# EAGLE design controller_board (EAGLE 9.4.0)
Assembly variants: Minimal, FullAwesome
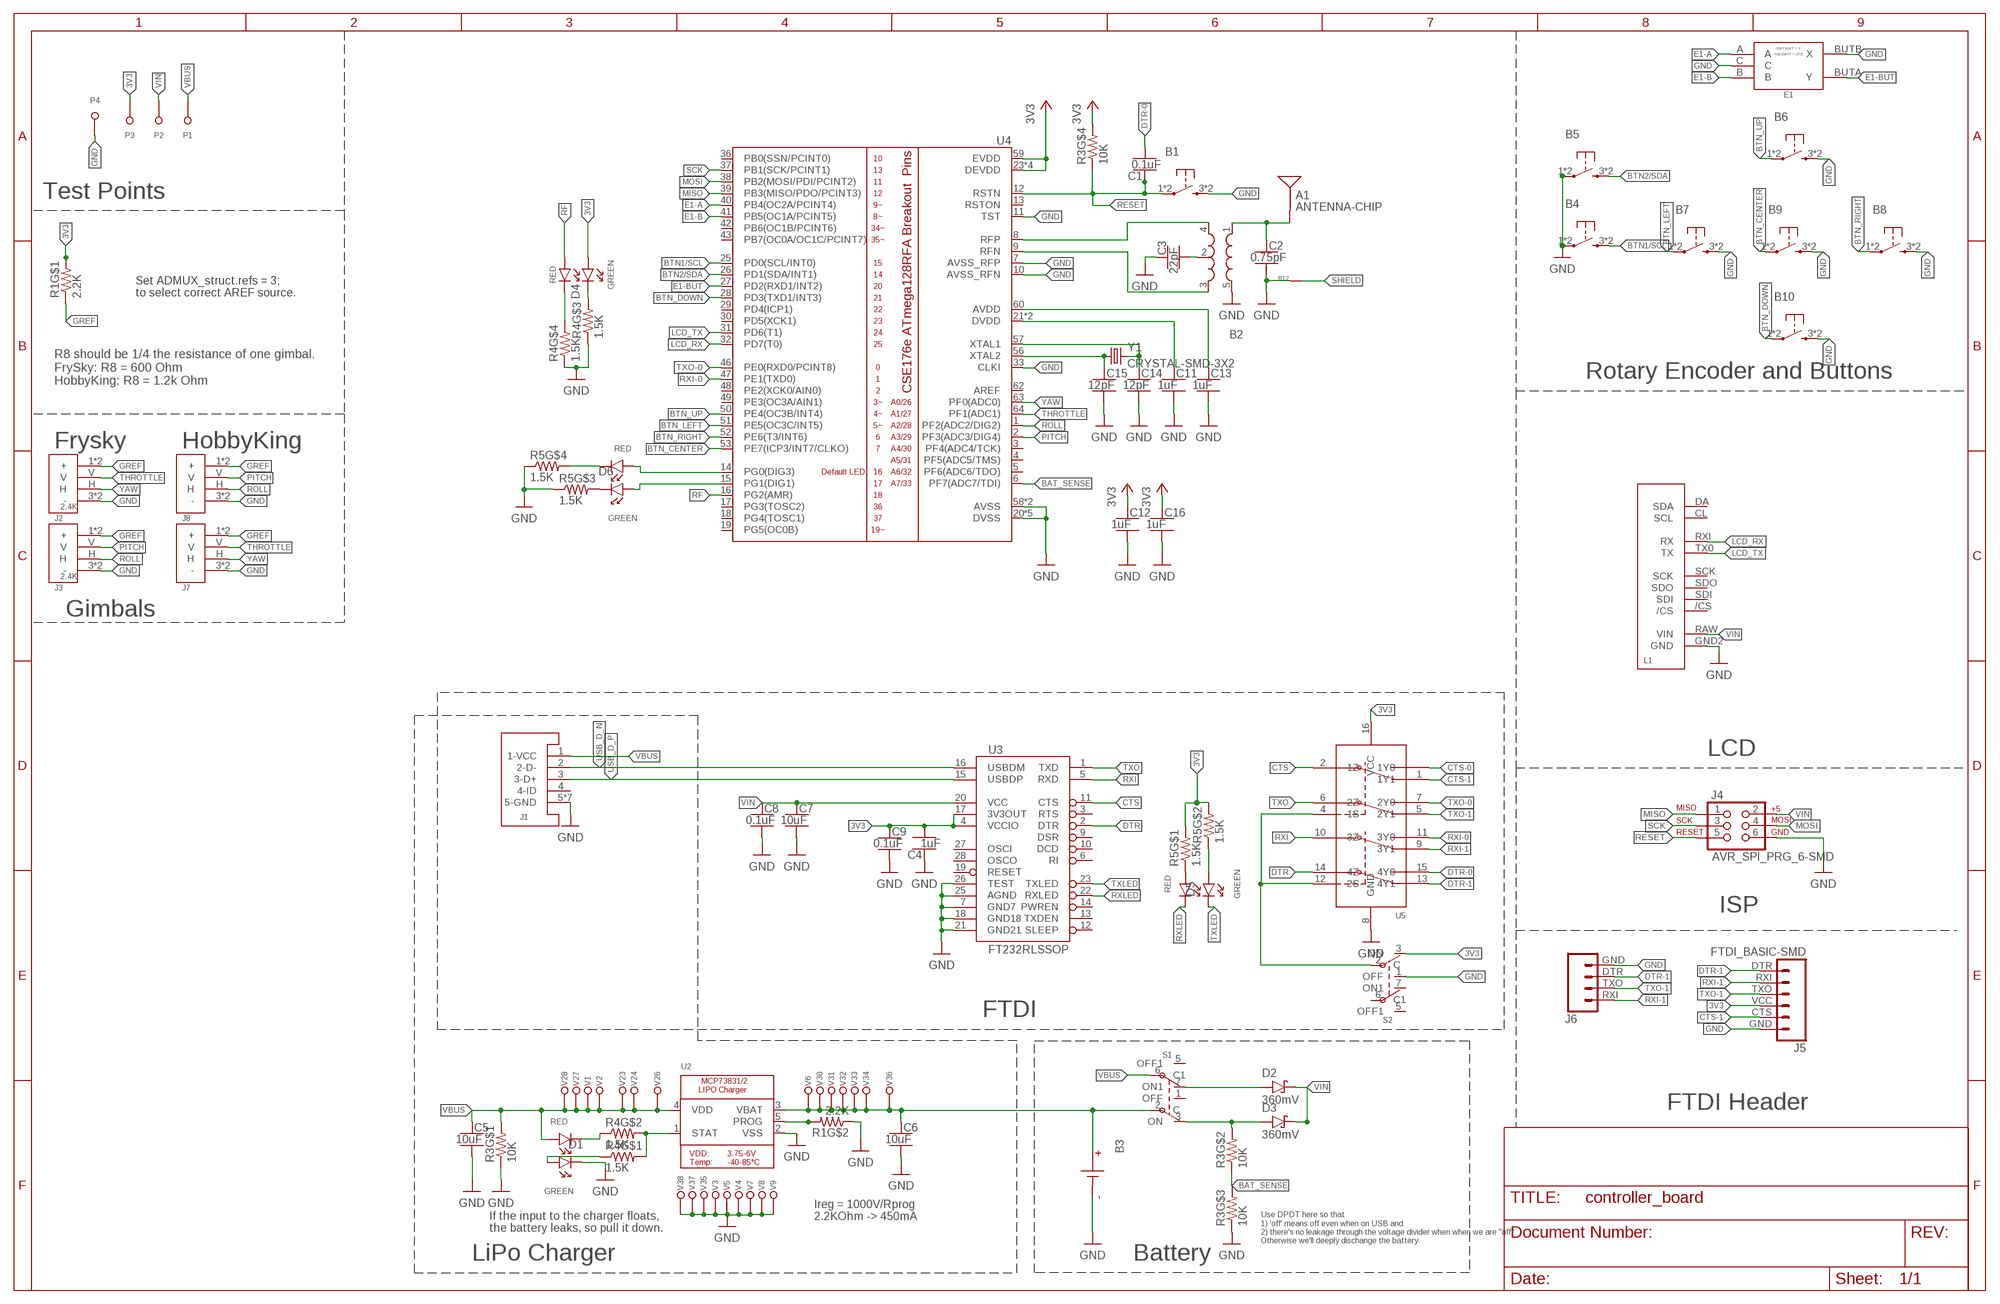
[diagram p0: schematic, sheet 1]
FRAME1 (FRAME_B_L): CREATOR: Unknown; DIST: Unknown; DISTPN: Unknown

## Parts
A1  ANTENNA-CHIP  [ANTENNA-CHIP]
B1  PUSHBUTTON_-4.5X4.5  [4.5MM_TACTILE_SWITCH_TL3305AF160QG]
B2  BALUN0805  [BALUN]
B3  BATTERY-SMD  [MOLEX-BATTERY-CONNECTOR-SMD-51005-2P]
B4  PUSHBUTTON_-4.5X4.5  [4.5MM_TACTILE_SWITCH_TL3305AF160QG]  (not fitted in variant Minimal)
B5  PUSHBUTTON_-4.5X4.5  [4.5MM_TACTILE_SWITCH_TL3305AF160QG]  (not fitted in variant Minimal)
B6  PUSHBUTTON_-4.5X4.5  [4.5MM_TACTILE_SWITCH_TL3305AF160QG]
B7  PUSHBUTTON_-4.5X4.5  [4.5MM_TACTILE_SWITCH_TL3305AF160QG]
B8  PUSHBUTTON_-4.5X4.5  [4.5MM_TACTILE_SWITCH_TL3305AF160QG]
B9  PUSHBUTTON_-4.5X4.5  [4.5MM_TACTILE_SWITCH_TL3305AF160QG]
B10  PUSHBUTTON_-4.5X4.5  [4.5MM_TACTILE_SWITCH_TL3305AF160QG]
B12  NET_BRIDGE  [NET_BRIDGE]
C1  0.1uF  CAPACITOR-NP_SMD-0603_CERAMIC-0.1UF  [CAPC1608X100]
C2  0.75pF  CAPACITOR-NP_SMD-0603_CERAMIC-0.75PF  [CAPC1608X100]
C3  22pF  CAPACITOR-NP_SMD-0603_CERAMIC-22PF  [CAPC1608X100]
C4  1uF  CAPACITOR-NP_SMD-0603_CERAMIC-1UF  [CAPC1608X100]
C5  10uF  CAPACITOR-NP_SMD-0603_CERAMIC-10UF  [CAPC1608X100]
C6  10uF  CAPACITOR-NP_SMD-0603_CERAMIC-10UF  [CAPC1608X100]
C7  10uF  CAPACITOR-NP_SMD-0603_CERAMIC-10UF  [CAPC1608X100]  (not fitted in variant Minimal)
C8  0.1uF  CAPACITOR-NP_SMD-0603_CERAMIC-0.1UF  [CAPC1608X100]  (not fitted in variant Minimal)
C9  0.1uF  CAPACITOR-NP_SMD-0603_CERAMIC-0.1UF  [CAPC1608X100]  (not fitted in variant Minimal)
C11  1uF  CAPACITOR-NP_SMD-0603_CERAMIC-1UF  [CAPC1608X100]
C12  1uF  CAPACITOR-NP_SMD-0603_CERAMIC-1UF  [CAPC1608X100]
C13  1uF  CAPACITOR-NP_SMD-0603_CERAMIC-1UF  [CAPC1608X100]
C14  12pF  CAPACITOR-NP_SMD-0603_CERAMIC-12PF  [CAPC1608X100]
C15  12pF  CAPACITOR-NP_SMD-0603_CERAMIC-12PF  [CAPC1608X100]
C16  1uF  CAPACITOR-NP_SMD-0603_CERAMIC-1UF  [CAPC1608X100]
D1  LED-2X-GREEN/RED-1.6X1.5MM  [LED-2X-LITE-ON-1.6MMX1.5MM]
D2  360mV  DIODE-SCHOTTKY_-SMD-SOD123  [SODFL3516X96]
D3  360mV  DIODE-SCHOTTKY_-SMD-SOD123  [SODFL3516X96]
D4  LED-2X-GREEN/RED-1.6X1.5MM  [LED-2X-LITE-ON-1.6MMX1.5MM]
D5  LED-2X-GREEN/RED-1.6X1.5MM  [LED-2X-LITE-ON-1.6MMX1.5MM]  (not fitted in variant Minimal)
D6  LED-2X-GREEN/RED-1.6X1.5MM  [LED-2X-LITE-ON-1.6MMX1.5MM]
E1  ROTARY-ENCODER-W/BUTTON-BOURNS-PEC12R-4217F  [BOURNS-PEC12R]
J1  USB-MICROA-AMPHENOL-10118192-0001LF  [USB-MICROA-10118192-0001LF]  (not fitted in variant Minimal)
J2  2.4K  FRSKY-GIMBAL-FRYSKY  [JST-13-PTH]  (not fitted in variant Minimal)
J3  2.4K  FRSKY-GIMBAL-FRYSKY  [JST-13-PTH]  (not fitted in variant Minimal)
J4  AVR_SPI_PRG_6-SMD  [2X3-SMD]
J5  FTDI_BASIC-SMD  [FTDI-BASIC-SMD]
J6  FTDI-4PIN-RIGHT-ANGLE-SMD  [HEADER-2X2-0.1IN-MALE-RIGHT-ANGLE-SMD]
J7  FRSKY-GIMBAL-2X-SERVO-SMD  [2X-SERVO-SMD]
J8  FRSKY-GIMBAL-2X-SERVO-SMD  [2X-SERVO-SMD]
L1  SPARKFUN_SERLCD_SERIAL_REDUCED-SMD  [SPARKFUN_SERLCD_16X2_REDUCED_SMD]
P1  TEST-POINT  [TEST-POINT-KEYSTONE-5000]  (not fitted in variant Minimal)
P2  TEST-POINT  [TEST-POINT-KEYSTONE-5000]  (not fitted in variant Minimal)
P3  TEST-POINT  [TEST-POINT-KEYSTONE-5000]  (not fitted in variant Minimal)
P4  TEST-POINT  [TEST-POINT-KEYSTONE-5000]  (not fitted in variant Minimal)
R1  2.2K  RESISTOR-PACK-4X-2.2K  [RESCAXS50P200X100X45-8]
R3  10K  RESISTOR-PACK-4X-10K  [RESCAXS50P200X100X45-8]
R4  1.5K  RESISTOR-PACK-4X-1.5K  [RESCAXS50P200X100X45-8]
R5  1.5K  RESISTOR-PACK-4X-1.5K  [RESCAXS50P200X100X45-8]
S1  SWITCH-DPDT-300MA-6V-SMD  [JS202011JCQN]
S2  SWITCH-DPDT-300MA-6V-SMD  [JS202011JCQN]
U2  MCP73831T-2ACI/OT  MCP73831/2  [SOT23-5]
U3  FT232RLSSOP  [SSOP28DB]  (not fitted in variant Minimal)
U4  ATMEGA128RFA1  [QFN-64]
U5  DPDT-X2  [SOP65P640X110-16]  (not fitted in variant Minimal)
V1  LOCKED-VIA-0.2  [VIA-0.2MM]
V2  LOCKED-VIA-0.2  [VIA-0.2MM]
V3  LOCKED-VIA-0.2  [VIA-0.2MM]
V4  LOCKED-VIA-0.2  [VIA-0.2MM]
V5  LOCKED-VIA-0.2  [VIA-0.2MM]
V6  LOCKED-VIA-0.2  [VIA-0.2MM]
V7  LOCKED-VIA-0.2  [VIA-0.2MM]
V8  LOCKED-VIA-0.2  [VIA-0.2MM]
V9  LOCKED-VIA-0.2  [VIA-0.2MM]
V23  LOCKED-VIA-0.2  [VIA-0.2MM]
V24  LOCKED-VIA-0.2  [VIA-0.2MM]
V26  LOCKED-VIA-0.2  [VIA-0.2MM]
V27  LOCKED-VIA-0.2  [VIA-0.2MM]
V28  LOCKED-VIA-0.2  [VIA-0.2MM]
V30  LOCKED-VIA-0.2  [VIA-0.2MM]
V31  LOCKED-VIA-0.2  [VIA-0.2MM]
V32  LOCKED-VIA-0.2  [VIA-0.2MM]
V33  LOCKED-VIA-0.2  [VIA-0.2MM]
V34  LOCKED-VIA-0.2  [VIA-0.2MM]
V35  LOCKED-VIA-0.2  [VIA-0.2MM]
V36  LOCKED-VIA-0.2  [VIA-0.2MM]
V37  LOCKED-VIA-0.2  [VIA-0.2MM]
V38  LOCKED-VIA-0.2  [VIA-0.2MM]
Y1  CRYSTAL-SMD-3X2  [OSCCC320X250X85]

## Nets
3V3 [PWR]: C4.2 C9.1 C12.1 C16.1 D4.A1 J5.VCC P3.T R1.5 R3.8 R5.5 R5.6 S2.3(ON) U3.4(VCCIO) U3.17(3V3OUT) U4.23(DEVDD) U4.34(DEVDD) U4.44(DEVDD) U4.54(DEVDD) U4.59(EVDD) U5.16(VCC)
ANTENNA [RFSIG]: A1.FEED(SIGNAL) B2.1(IN) C2.1
BAT_SENSE: R3.3 R3.7 U4.6(PF7(ADC7/TDI))
BCAP: B2.2(GND) C3.2
BPOS [HIGH-I]: B3.P C6.1 S1.2(C) U2.3(VBAT) V6.P1(N) V30.P1(N) V31.P1(N) V32.P1(N) V33.P1(N) V34.P1(N) V36.P1(N)
BTN1/SCL: B4.3 B4.4 U4.25(PD0(SCL/INT0))
BTN2/SDA: B5.3 B5.4 U4.26(PD1(SDA/INT1))
BTN_CENTER: B9.1 B9.2 U4.53(PE7(ICP3/INT7/CLKO))
BTN_DOWN: B10.1 B10.2 U4.28(PD3(TXD1/INT3))
BTN_LEFT: B7.1 B7.2 U4.51(PE5(OC3C/INT5))
BTN_RIGHT: B8.1 B8.2 U4.52(PE6(T3/INT6))
BTN_UP: B6.1 B6.2 U4.50(PE4(OC3B/INT4))
CLK_NEG: C15.1 U4.56(XTAL2) Y1.1
CLK_POS: C14.1 U4.57(XTAL1) Y1.3
CTS: U3.11(CTS) U5.2(1Z)
CTS-0: U5.3(1Y0)
CTS-1: J5.CTS U5.1(1Y1)
DTR: U3.2(DTR) U5.14(4Z)
DTR-0: C1.2 U5.15(4Y0)
DTR-1: J5.DTR J6.DTR U5.13(4Y1)
E1-A: E1.A U4.40(PB4(OC2A/PCINT4))
E1-B: E1.B U4.41(PB5(OC1A/PCINT5))
E1-BUT: E1.BUTA(Y) U4.27(PD2(RXD1/INT2))
GND [PWR]: B1.3 B1.4 B2.5(GND) B3.G2(N) B3.G3(N) B3.G(N) B4.1 B4.2 B5.1 B5.2 B6.3 B6.4 B7.3 B7.4 B8.3 B8.4 B9.3 B9.4 B10.3 B10.4 B12.P1 C2.2 C3.1 C4.1 C5.2 C6.2 C7.2 C8.2 C9.2 C11.2 C12.2 C13.2 C14.2 C15.2 C16.2 D1.C1 E1.BUTB(X) E1.C J1.5(5-GND) J1.6(5-GND) J1.7(5-GND) J1.8(5-GND) J1.9(5-GND) J1.10(5-GND) J1.11(5-GND) J2.3(-) J2.6(-) J3.3(-) J3.6(-) J4.6 J5.GND J6.GND J7.3(-) J7.6(-) J8.3(-) J8.6(-) L1.GND2(GND) P4.T R1.3 R3.2 R3.4 R4.1 R4.2 R5.1 R5.2 S2.1(OFF) U2.2(VSS) U3.7(GND7) U3.18(GND18) U3.21(GND21) U3.25(AGND) U3.26(TEST) U4.7(AVSS_RFP) U4.10(AVSS_RFN) U4.11(TST) U4.20(DVSS) U4.24(DVSS) U4.33(CLKI) U4.35(DVSS) U4.45(DVSS) U4.55(DVSS) U4.58(AVSS) U4.61(AVSS) U5.8(GND) V3.P1(N) V4.P1(N) V5.P1(N) V7.P1(N) V8.P1(N) V9.P1(N) V35.P1(N) V37.P1(N) V38.P1(N)
GREF: J2.1(+) J2.4(+) J3.1(+) J3.4(+) J7.1(+) J7.4(+) J8.1(+) J8.4(+) R1.4
LCD_RX: L1.RXI(RX) U4.32(PD7(T0))
LCD_TX: L1.TX0(TX) U4.31(PD6(T1))
MISO: J4.1 U4.39(PB3(MISO/PDO/PCINT3))
MOSI: J4.4 U4.38(PB2(MOSI/PDI/PCINT2))
N$1: D1.A1 R4.4
N$2: D1.C2 R4.3
N$3: D5.A1 R5.3
N$4: D6.C2 R5.8
N$5: D6.C1 R5.7
N$6: D4.C1 R4.7
N$7: D5.A2 R5.4
N$8: D6.A2 U4.14(PG0(DIG3))
N$9: D6.A1 U4.15(PG1(DIG1))
N$11: R4.5 R4.6 U2.1(STAT)
N$12: R1.6 U2.5(PROG)
N$13: D4.C2 R4.8
N$14: D2.2(A) S1.7(ON1)
N$20: C11.1 U4.21(DVDD) U4.22(DVDD)
N$21: C13.1 U4.60(AVDD)
PITCH: J3.V J8.V U4.2(PF3(ADC3/DIG4))
PROG_SEL: S2.2(C) U5.4(1S) U5.12(2S)
RESET: B1.1 B1.2 C1.1 J4.5 R3.1 U4.12(RSTN)
RF: D4.A2 U4.16(PG2(AMR))
RF_N: B2.3(OUT2) U4.9(RFN)
RF_P: B2.4(OUT1) U4.8(RFP)
ROLL: J3.H J8.H U4.1(PF2(ADC2/DIG2))
RXI: U3.5(RXD) U5.10(3Z)
RXI-0: U4.47(PE1(TXD0)) U5.11(3Y0)
RXI-1: J5.RXI J6.RXI U5.9(3Y1)
RXLED: D5.C2 U3.22(RXLED)
SCK: J4.3 U4.37(PB1(SCK/PCINT1))
SHIELD: B12.P2
THROTTLE: J2.V J7.V U4.64(PF1(ADC1))
TXLED: D5.C1 U3.23(TXLED)
TXO: U3.1(TXD) U5.6(2Z)
TXO-0: U4.46(PE0(RXD0/PCINT8)) U5.7(2Y0)
TXO-1: J5.TXO J6.TXO U5.5(2Y1)
USB_D_N: J1.2(2-D-) U3.16(USBDM)
USB_D_P: J1.3(3-D+) U3.15(USBDP)
VBAT [HIGH-I]: D3.2(A) R3.6 S1.3(ON)
VBUS [HIGH-I]: C5.1 D1.A2 J1.1(1-VCC) P1.T R3.5 S1.6(C1) U2.4(VDD) V1.P1(N) V2.P1(N) V23.P1(N) V24.P1(N) V26.P1(N) V27.P1(N) V28.P1(N)
VIN [HIGH-I]: C7.1 C8.1 D2.1(C) D3.1(C) J4.2 L1.RAW(VIN) P2.T U3.20(VCC)
YAW: J2.H J7.H U4.63(PF0(ADC0))
Unconnected: J1.4(4-ID) L1./CS L1.CL(SCL) L1.DA(SDA) L1.SCK L1.SDI L1.SDO R1.1 R1.2 R1.7 R1.8 S1.1(OFF) S1.5(OFF1) S2.5(OFF1) S2.6(C1) S2.7(ON1) U3.3(RTS) U3.6(RI) U3.9(DSR) U3.10(DCD) U3.12(SLEEP) U3.13(TXDEN) U3.14(PWREN) U3.19(RESET) U3.27(OSCI) U3.28(OSCO) U4.3(PF4(ADC4/TCK)) U4.4(PF5(ADC5/TMS)) U4.5(PF6(ADC6/TDO)) U4.13(RSTON) U4.17(PG3(TOSC2)) U4.18(PG4(TOSC1)) U4.19(PG5(OC0B)) U4.29(PD4(ICP1)) U4.30(PD5(XCK1)) U4.36(PB0(SSN/PCINT0)) U4.42(PB6(OC1B/PCINT6)) U4.43(PB7(OC0A/OC1C/PCINT7)) U4.48(PE2(XCK0/AIN0)) U4.49(PE3(OC3A/AIN1)) U4.62(AREF)

## Notes on the sheet
- Test Points
- Set ADMUX_struct.refs = 3;
  to select correct AREF source.
- Rotary Encoder and Buttons
- R8 should be 1/4 the resistance of one gimbal.
  FrySky: R8 = 600 Ohm
  HobbyKing: R8 = 1.2k Ohm
- Frysky | HobbyKing
- Gimbals
- LCD
- ISP
- FTDI
- FTDI Header
- Ireg = 1000V/Rprog
  2.2KOhm -> 450mA
- If the input to the charger floats, 
  the battery leaks, so pull it down.
- Use DPDT here so that 
  1) 'off' means off even when on USB and 
  2) there's no leakage through the voltage divider when when we are "off"  
  Otherwise we'll deeply dischange the battery.
- LiPo Charger | Battery

## Library data of the parts
A1 = quadparts_prebuilt:ANTENNA: Single endded antenna.; CREATOR: Swanson; DATASHEET: http://www.linxtechnologies.com/resources/data-guides/ant-xxx-chp-x.pdf; DESC: RF ANT 2.4GHZ CHIP SOLDER SMD; DIST: Digikey; DISTPN: ANT-2.45-CHPCT-ND; MFR: Linx Technologies Inc.; MOUNTING: SMD; MPN: ANT-2.45-CHP-T; PRICE: 3.16; REVIEWER: Swanson
B1 B4-B10 = quadparts_prebuilt:PUSHBUTTON_: "Tactile" or "clicky" button.; CREATOR: Swanson; DESC: SWITCH TACTILE SPST-NO 50MA 12V; DIST: DIGIKEY; DISTPN: EG5350CT-ND; MFR: E-Switch; MOUNTING: SMD; MPN: TL3305AF160QG
B2 = quadparts_prebuilt:BALUN: A balun to convert differential radio-frequency outputs from the microcontroller into a single-ended driver for the antenna.; CREATOR: Swanson; DATASHEET: http://katalog.we-online.de/pbs/datasheet/748421245.pdf; DESC: BALUN 2.4GHZ-2.5GHZ 50/100 0805; DIST: Digikey; DISTPN: 732-2230-1-ND; MFR: Wurth Electronics Inc.; MOUNTING: SMD; MPN: 748421245; PACKAGE: 0805; PRICE: 2.63; REVIEWER: Swanson
B3 = quadparts_prebuilt:BATTERY: Connections for a battery.; CREATOR: Swanson; DIST: ALIBABA; DISTPN: https://www.alibaba.com/product-detail/Molex-51005-51006-2-pin-female_60863668004.html?spm=a2700.7724857.normalList.97.20ef28e64nZnNK; MFR: UNKNOWN; MOUNTING: SMD; MPN: UNKNOWN
B12 = custom:NET_BRIDGE; CREATOR: Michael Gonzalez; DIST: NA; DISTPN: NA
C1 C8 C9 = quadparts_prebuilt:CAPACITOR-NP_: Nonpolarized capacitor; CREATOR: Swanson; DESC: CAP CER 0.1UF 10V X7R 0603; DIST: Digikey; DISTPN: 399-1095-1-ND; MFR: KEMET; MOUNTING: SMD; MPN: C0603C104K8RACTU; PACKAGE: 0603
C2 = quadparts_prebuilt:CAPACITOR-NP_: Nonpolarized capacitor; CREATOR: Swanson; DESC: CAP CER 0.75PF 50V NPO 0603; DIST: Digikey; DISTPN: 311-3843-1-ND; MFR: Yageo; MOUNTING: SMD; MPN: CC0603BRNPO9BNR75; PACKAGE: 0603
C3 = quadparts_prebuilt:CAPACITOR-NP_: Nonpolarized capacitor; CREATOR: Swanson; DESC: CAP CER 22PF 6.3V NP0 0603; DIST: Digikey; DISTPN: 478-11384-1-ND; MFR: AVX Corporation; MOUNTING: SMD; MPN: 06036A220KAT2A; PACKAGE: 0603
C4 C11-C13 C16 = quadparts_prebuilt:CAPACITOR-NP_: Nonpolarized capacitor; CREATOR: Swanson; DESC: CAP CER 1UF 10V X5R 0603; DIST: Digikey; DISTPN: 1276-1182-1-ND; MFR: Samsung Electro-Mechanics; MOUNTING: SMD; MPN: CL10A105KP8NNNC; PACKAGE: 0603
C5-C7 = quadparts_prebuilt:CAPACITOR-NP_: Nonpolarized capacitor; CREATOR: Swanson; DESC: CAP CER 10UF 6.3V X5R 0603; DIST: Digikey; DISTPN: 1276-1119-1-ND; MFR: Samsung Electro-Mechanics; MOUNTING: SMD; MPN: CL10A106MQ8NNNC; PACKAGE: 0603
C14 C15 = quadparts_prebuilt:CAPACITOR-NP_: Nonpolarized capacitor; CREATOR: Swanson; DESC: CAP CER 12PF 10V C0G/NP0 0603; DIST: Digikey; DISTPN: 720-1655-1-ND; MFR: Vishay Vitramon; MOUNTING: SMD; MPN: VJ0603A120FXQCW1BC; PACKAGE: 0603
D1 D4-D6 = RemoteParts:LED-2X; COLOR1: RED; COLOR2: GREEN; CREATOR: Swanson; DESC: LED GREEN/RED CLEAR CHIP SMD; DIST: DIGIKEY; DISTPN: 160-2252-1-ND; MFR: Lite-On Inc.; MOUNTING: SMD; MPN: LTST-C195TGKRKT; PACKAGE: 4SMD
D2 D3 = quadparts_prebuilt:DIODE-SCHOTTKY_: Schottky diode; CREATOR: Swanson; DESC: DIODE SCHOTTKY 30V 1.5A SFLAT; DIST: Digikey; DISTPN: CRS08QMCT-ND; MFR: Toshiba Semiconductor and Storage; MOUNTING: SMD; MPN: CRS08(TE85L,Q,M); REVIEWER: Swanson
E1 = RemoteParts:ROTARY-ENCODER-W/BUTTON; AUX1DIST: DIGIKEY; AUX1DISTPN: 1722-1241-ND; CREATOR: Swanson; DETENT: Y; DIST: DIGIKEY; DISTPN: PEC12R-4217F-S0024-ND; HEIGHT: 17.5; MOUNTING: TH
J1 = RemoteParts:USB; CREATOR: Swanson; DIST: DIGIKEY; DISTPN: 609-4613-1-ND; MOUNTING: SMD
J2 = RemoteParts:FRSKY-GIMBAL; CREATOR: Swanson; DESC: CONN HEADER VERT 12POS 2MM; DIST: Digikey; DISTPN: A100106-ND; MFR: TE Connectivity AMP Connectors; MOUNTING: TH; MPN: 1-1735446-2
J3 = RemoteParts:FRSKY-GIMBAL; CREATOR: Swanson; DESC: CONN HEADER VERT 12POS 2MM; DIST: Digikey; DISTPN: A100106-ND; MFR: TE Connectivity AMP Connectors; MOUNTING: TH; MPN: 1-1735446-2; SPICEPREFIX: E
J4 = quadparts_prebuilt:AVR_SPI_PRG_6: AVR ISP 6 Pin This is the in-system programming (ISP) connector for Atmel Microcontrollers programming.; CREATOR: Swanson; DESC: CONN HEADER SMD 6POS 2.54MM; DIST: Digikey; DISTPN: 609-3487-2-ND; MFR: Amphenol ICC (FCI); MOUNTING: SMD; MPN: 95278-101A06LF
J5 = quadparts_prebuilt:FTDI_BASIC: FTDI (USB-serial converter) header bins with labels.; CREATOR: Swanson; DESC: CONN HEADER SMD R/A 6POS 2.54MM; DIST: DIGIKEY; DISTPN: 952-3235-ND; LEFT_PIN: B; MFR: Harwin Inc.; MOUNTING: SMD; MPN: M20-8890645; RIGHT_PIN: G
J6 = quadparts_prebuilt:FTDI-4PIN; CREATOR: Swanson; DIST: DIGIKEY; DISTPN: SAM15344-ND; MOUNTING: SMD
J7 J8 = RemoteParts:FRSKY-GIMBAL; CREATOR: Swanson; DESC: CONN HEADER SMD R/A 6POS 2.54MM; DIST: DIGIKEY; DISTPN: 952-3235-ND; MFR: Harwin Inc.; MOUNTING: SMD; MPN: M20-8890645
L1 = RemoteParts:SPARKFUN_SERLCD_SERIAL_REDUCED; AUX1DIST: DIGIKEY; AUX1DISTPN: 952-1842-ND; AUX2DIST: Digikey; AUX2DISTPN: S5641-ND; CREATOR: Swanson; DIST: Sparkfun; DISTPN: LCD-14072
P1-P4 = RemoteParts:TEST-POINT; CREATOR: Swanson; DESC: PC TEST POINT MINIATURE BLACK; DIST: DIGIKEY; DISTPN: 36-5001-ND; MFR: Keystone Electronics; MOUNTING: TH; MPN: 5001
R1 = quadparts_prebuilt:RESISTOR-PACK-4X; CREATOR: Swanson; DIST: DIGIKEY; DISTPN: Y10222CT-ND; MOUNTING: SMD
R3 = quadparts_prebuilt:RESISTOR-PACK-4X; CREATOR: Swanson; DESC: RES ARRAY 4 RES 10K OHM 0804; DIST: DIGIKEY; DISTPN: Y10103CT-ND; MFR: Panasonic Electronic Components; MOUNTING: SMD; MPN: EXB-N8V103JX; PACKAGE: 0804
R4 R5 = quadparts_prebuilt:RESISTOR-PACK-4X; CREATOR: Swanson; DIST: DIGIKEY; DISTPN: Y10152CT-ND; MOUNTING: SMD
S1 S2 = RemoteParts:SWITCH-DPDT; CREATOR: Swanson; DIST: DIGIKEY; DISTPN: CKN10723CT-ND; MOUNTING: SMD
U2 = RemoteParts:MCP73831/2: MCP73831/2 LIPO Charger VDD: 3.75 - 6V Temp -40 - 85°C Programmable Charge Rate: 15-500mA NOTE: STAT is a tri-state logic output on the MCP73831 and an open-drain output on the MCP73832. SOT23-5 with 4.2V output and tri-state logic on STAT = MCP73831T-2ACI/OT; CREATOR: Adafruit; DESC: IC CONTROLLR LI-ION 4.2V SOT23-5; DIST: DIGIKEY; DISTPN: MCP73831T-2ACI/OTCT-ND; MFR: Microchip Technology; MOUNTING: SMD; MPN: MCP73831T-2ACI/OT; PACKAGE: SOT23-5
U3 = RemoteParts:FT232RL: USB UART FT232RL 4th Generation USB UART (USB <-> Serial) Controller. Spark Fun Electronics SKU : COM-00650; CREATOR: Swanson; DIST: DIGIKEY; DISTPN: 768-1007-1-ND; MOUNTING: SMD
U4 = quadparts_prebuilt:ATMEGA128RFA1: ATmega128RFA1 8-bit AVR Microcontroller with Low Power 2.4GHz Transceiver for ZigBee and IEEE 802.15.4; CREATOR: Swanson; DATASHEET: http://www.atmel.com/Images/Atmel-8266-MCU_Wireless-ATmega128RFA1_Datasheet.pdf; DESC: IC RF TXRX+MCU 802.15.4 64VFQFN; DIST: Digikey; DISTPN: ATMEGA128RFA1-ZU-ND; MFR: Microchip Technology; MOUNTING: SMD; MPN: ATMEGA128RFA1-ZU; PACKAGE: QFN; PRICE: 10.21; REVIEWER: Swanson
U5 = RemoteParts:DPDT-X2; CREATOR: Swanson; DESC: IC ANALOG SWITCH DPDT 16TSSOP; DIST: DIGIKEY; DISTPN: 568-5300-1-ND; MFR: NXP USA Inc.; MOUNTING: SMD; MPN: NX3L2467PW,118
V1-V9 V23 V24 V26-V28 V30-V38 = quadparts_prebuilt:LOCKED-VIA: A via that be removed via ripup.; CREATOR: Swanson; DIST: NA; DISTPN: NA; MOUNTING: NONE
Y1 = quadparts_prebuilt:CRYSTAL: Crystals to provide clock references for microcontrollers, etc.; CREATOR: Swanson; DESC: CRYSTAL 16.0000MHZ 18PF SMD; DIST: DIGIKEY; DISTPN: 535-9134-1-ND; MFR: Abracon LLC; MOUNTING: SMD; MPN: ABM8-16.000MHZ-B2-T

## Net classes
1 HIGH-I: width 0.508 mm, drill 0.381 mm
2 RFSIG: width 1.016 mm

## Board
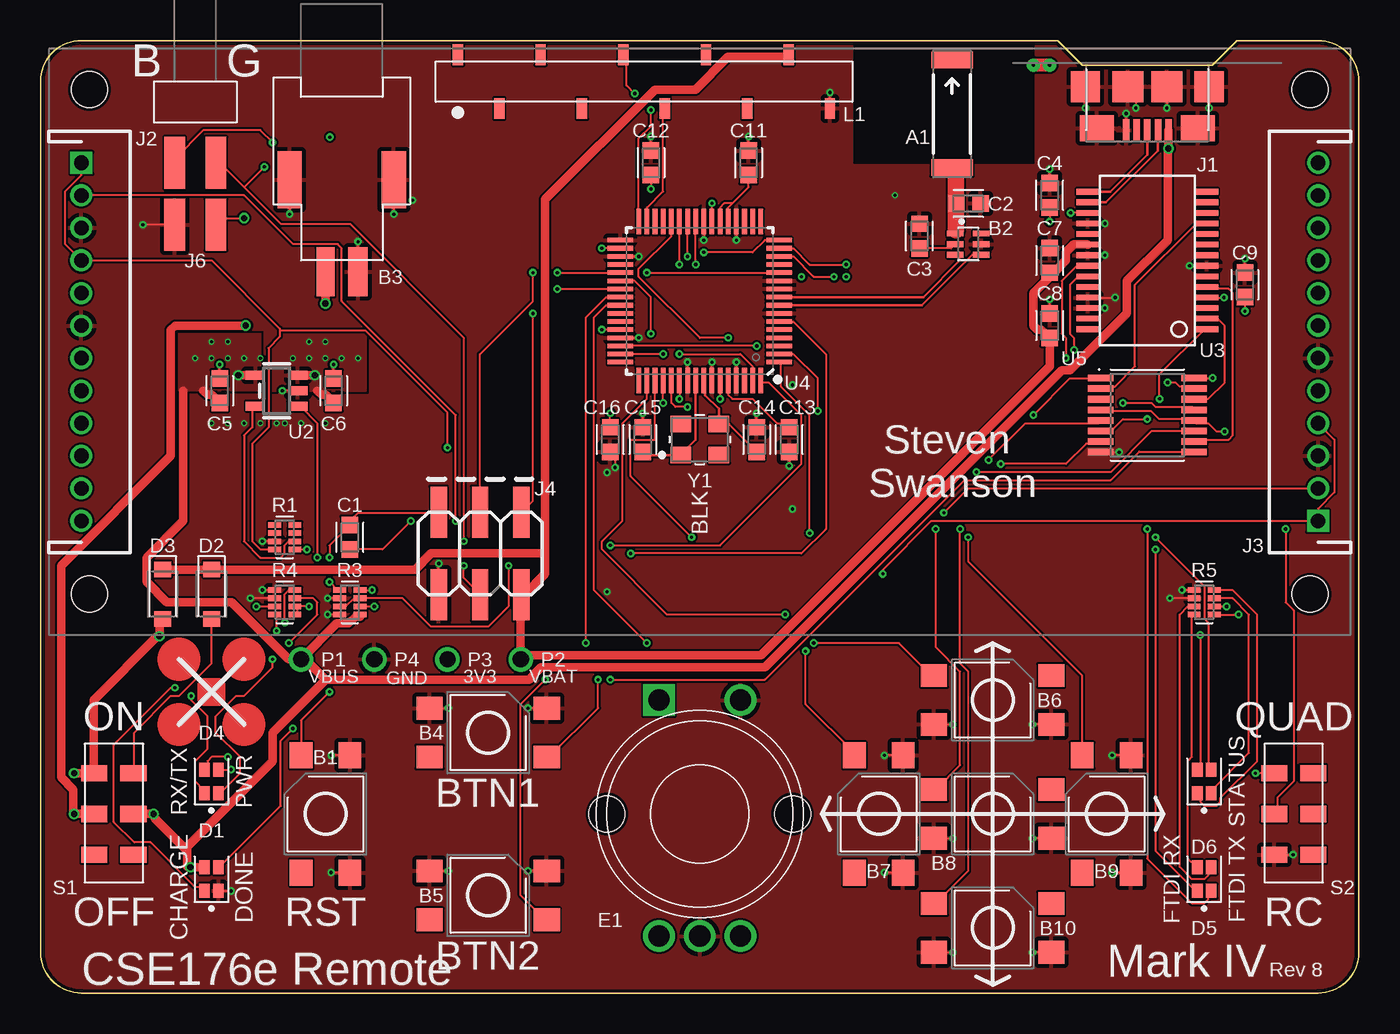
[diagram p1: board, top side]
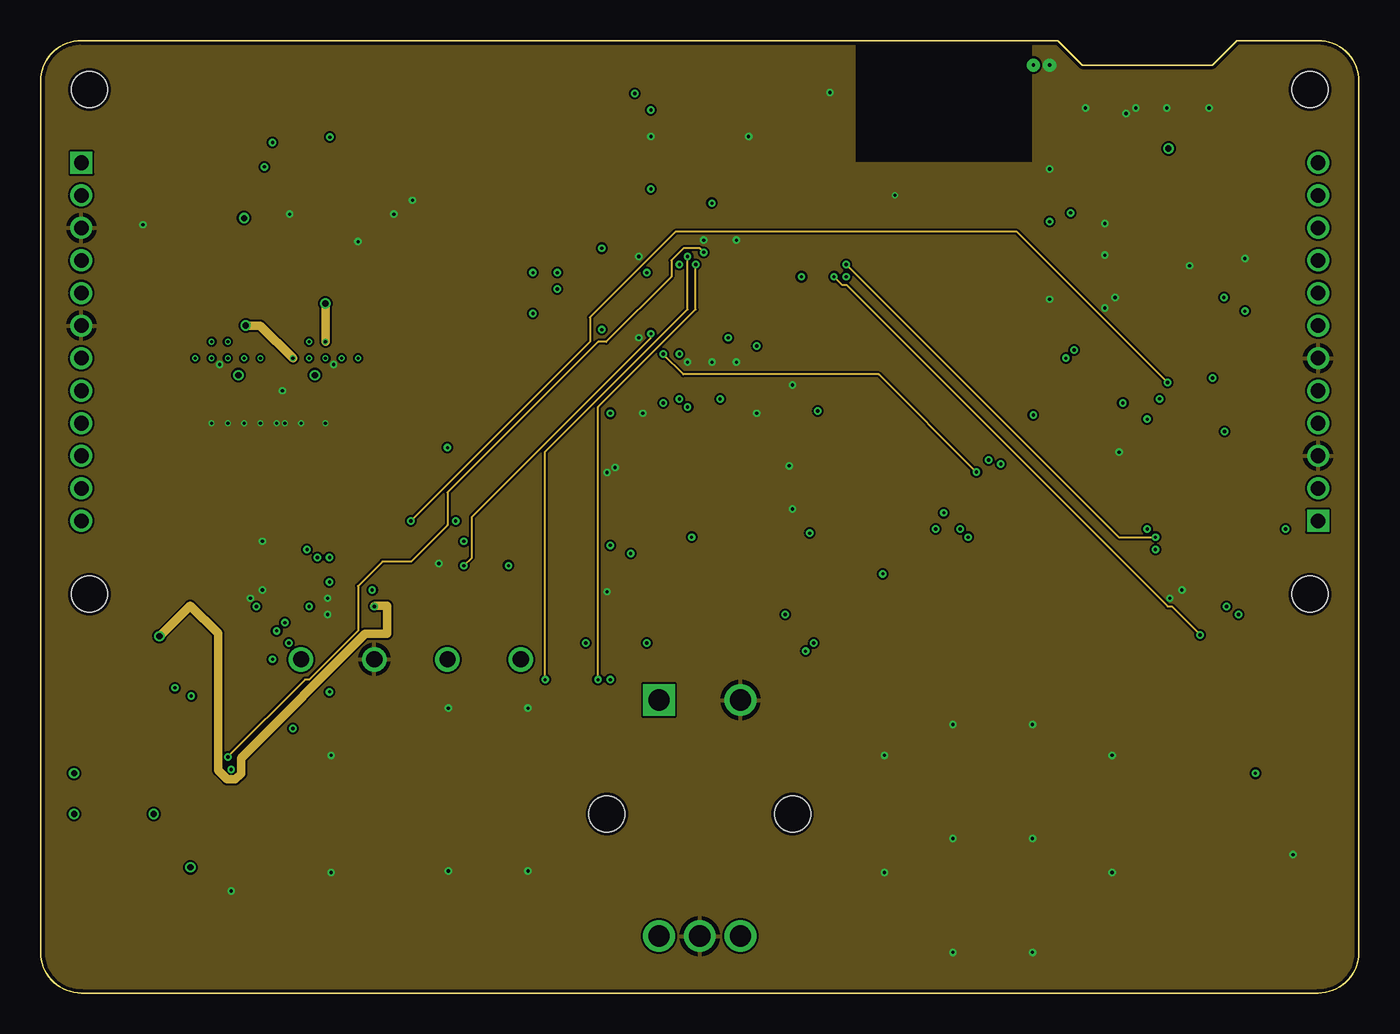
[diagram p2: board, inner layer Route2]
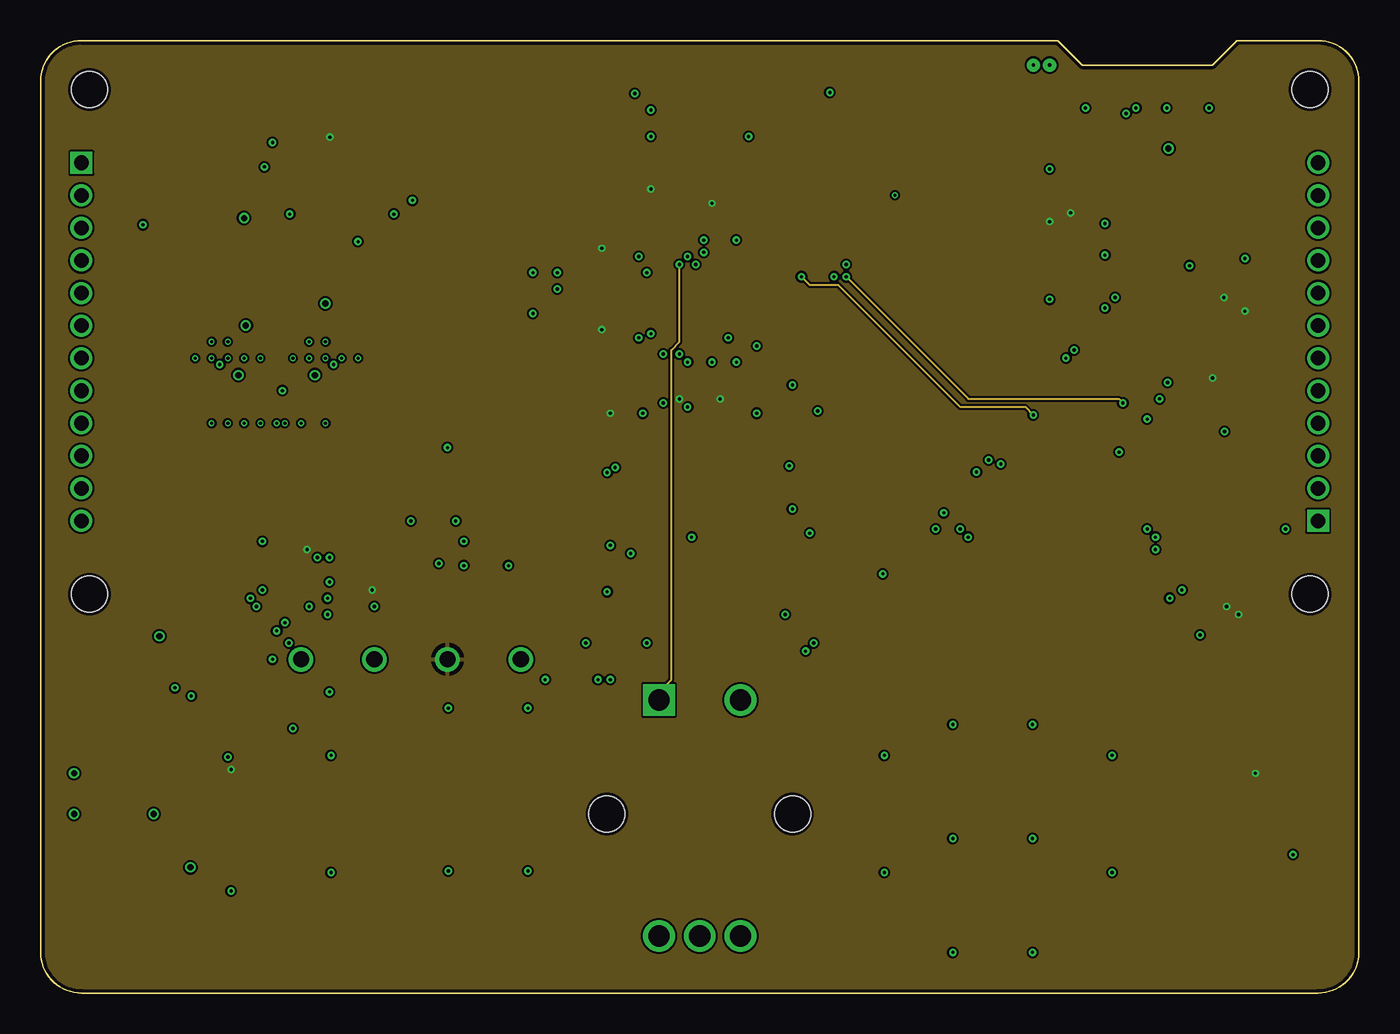
[diagram p3: board, inner layer Route15]
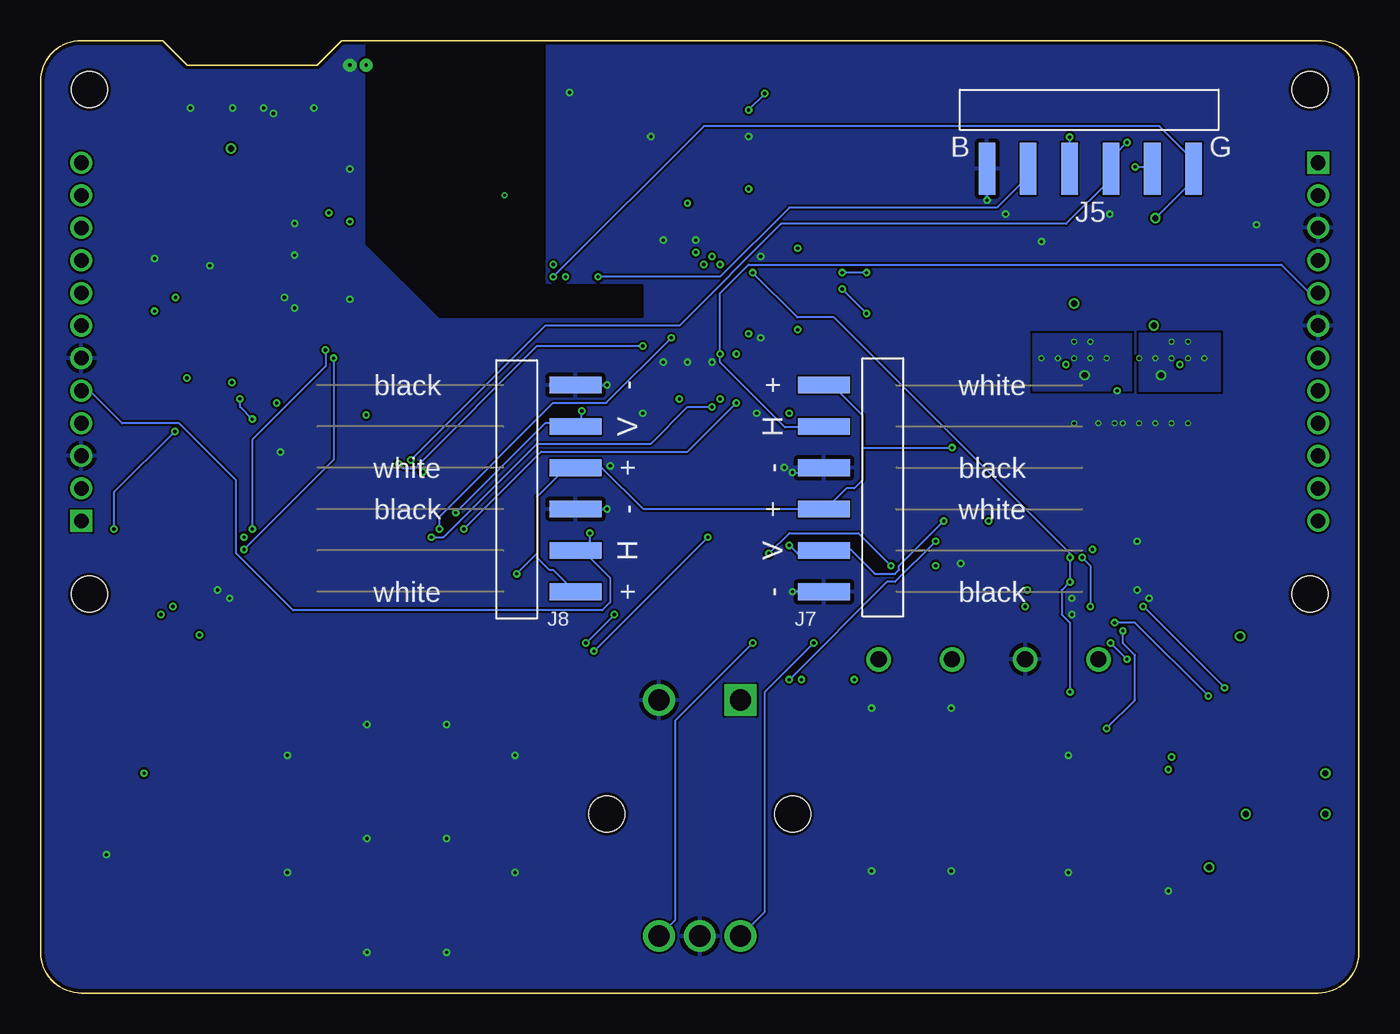
[diagram p4: board, bottom side, seen from below]

Size 81 x 58.5 mm. Coordinates in mm from the lower left corner, seen from the top.
Outline: 2.5,0 78.5,0 arc90 81,2.5 81,56 arc90 78.5,58.5 73.5,58.5 72,57 64,57 62.5,58.5 2.5,58.5 arc90 0,56 0,2.5 arc90 2.5,0
Copper layers (1*2*15*16): Top 0.035559375mm / dielectric 1.501140625mm / Route2 0.035559375mm / dielectric 0.149859375mm / Route15 0.035559375mm / dielectric 0.200659375mm / Bottom 0.035559375mm
Design rules "jlcpcb-4layer-5mil-small-cream": minimum track width 5mil, minimum drill 0.2mm, track to track 5mil, track to pad 5mil, pad to pad 5mil, via to via 5mil, smd to smd 5mil, copper to edge 0.2mm, drill to drill 10mil, minimum pad ring 3mil, minimum via ring 5mil, stop-mask expansion 3mil, vias tented up to drill 0.45mm, thermal gap 10mil
tRestrict: 4 lines
bRestrict: area 44,41.5 to 61,59

### Footprints (pad centres in the part's own frame; a part is rotated, then mirrored left to right if it is on the bottom)
ANTENNA-CHIP = smd 1.016 x 2.54: FEED -3.302,0; NC 3.302,0
4.5MM_TACTILE_SWITCH_TL3305AF160QG = smd 1.6 x 1.4: 1 -3.6,-1.5; 2 3.6,-1.5; 3 -3.6,1.5; 4 3.6,1.5
BALUN = smd 0.35 x 1: 1 -0.65,-0.8; 2 0,-0.8; 3 0.65,-0.8; 4 0.65,0.8; 5 0,0.8; 6 -0.65,0.8
MOLEX-BATTERY-CONNECTOR-SMD-51005-2P = smd 1.2 x 3: G -1,5.2 | smd 1.5 x 3.5: G2 -3.2,-0.45; G3 3.2,-0.45 | smd 1.1 x 3: P 1,5.2
NET_BRIDGE = drill 0.2 pad 0.813: P1 -0.5,0; P2 0.5,0
CAPC1608X100 = smd 1.009 x 1.015: 1 -0.753,0; 2 0.753,0
LED-2X-LITE-ON-1.6MMX1.5MM = smd 0.85 x 0.65: A1 -0.725,0.425; A2 -0.725,-0.425; C1 0.725,0.425; C2 0.725,-0.425
SODFL3516X96 = smd 0.962 x 1.029: 1 -1.525,0; 2 1.525,0
BOURNS-PEC12R = drill 1.3: A -2.5,-7.5; B 2.5,-7.5; BUTB 2.5,7; C 0,-7.5 | drill 1.3 square: BUTA -2.5,7 | hole 2.2: -5.7,0; 5.7,0
FRSKY-TARANIS-GIMBAL = hole 2.2: -27,-27; -27,27; -27,27; 27,-27; 27,27
USB-MICROA-10118192-0001LF = smd 0.4 x 1.35: 1 -1.3,0; 2 -0.65,0; 3 0,0; 4 0.65,0; 5 1.3,0 | smd 2.1 x 1.6: 6 3.1,-0.125; 7 -3.1,-0.125 | smd 1.8 x 1.9: 8 -3.8,-2.675; 11 3.8,-2.675 | smd 1.9 x 1.9: 9 1.2,-2.675; 10 -1.2,-2.675
JST-13-PTH = drill 0.9 square: 1 -2,0 | drill 0.9: 3 2,0; 4 4,0; 6 8,0; 7 10,0; 8 12,0; 9 14,0; 10 16,0; 11 18,0; 12 20,0; H 6,0; V 0,0
2X3-SMD = smd 1 x 3.15: 1 -2.54,-2.54; 2 -2.54,2.54; 3 0,-2.54; 4 0,2.54; 5 2.54,-2.54; 6 2.54,2.54
FTDI-BASIC-SMD = smd 1.02 x 3.17: CTS -3.81,0.635; DTR 6.35,0.635; GND -6.35,0.635; RXI 3.81,0.635; TXO 1.27,0.635; VCC -1.27,0.635
HEADER-2X2-0.1IN-MALE-RIGHT-ANGLE-SMD = smd 1.27 x 3.18: DTR 1.27,-8.806; GND -1.27,-8.806; RXI 1.27,-4.996; TXO -1.27,-4.996
2X-SERVO-SMD = smd 1.02 x 3.17: 1 -6.35,0.635; 3 -1.27,0.635; 4 1.27,0.635; 6 6.35,0.635; H -3.81,0.635; V 3.81,0.635
SPARKFUN_SERLCD_16X2_REDUCED_SMD = smd 0.635 x 1.27: /CS -7.24,14.336; CL 0.38,17.636; DA 2.92,14.336; GND2 8,14.336; RAW 5.46,17.636; RXI -4.7,17.636; SCK -14.86,17.636; SDI -9.78,17.636; SDO -12.32,14.336; TX0 -2.16,14.336 | hole 2.2: -37.5,-15.5; -37.5,15.5; 37.5,-15.5; 37.5,15.5
TEST-POINT-KEYSTONE-5000 = drill 1: T 0,0
RESCAXS50P200X100X45-8 = smd 0.79 x 0.339: 1 -0.62,0.75; 2 -0.62,0.25; 3 -0.62,-0.25; 4 -0.62,-0.75; 5 0.62,-0.75; 6 0.62,-0.25; 7 0.62,0.25; 8 0.62,0.75
JS202011JCQN = smd 1 x 1.6: 1 -2.5,1.2; 2 0,1.2; 3 2.5,1.2; 5 -2.5,-1.2; 6 0,-1.2; 7 2.5,-1.2
SOT23-5 = smd 0.55 x 1.2: 1 -0.95,-1.3; 2 0,-1.3; 3 0.95,-1.3; 4 0.95,1.3; 5 -0.95,1.3
SSOP28DB = smd 0.348 x 1.397: 1 -4.225,-3.656; 2 -3.575,-3.656; 3 -2.925,-3.656; 4 -2.275,-3.656; 5 -1.625,-3.656; 6 -0.975,-3.656; 7 -0.325,-3.656; 8 0.325,-3.656; 9 0.975,-3.656; 10 1.625,-3.656; 11 2.275,-3.656; 12 2.925,-3.656; 13 3.575,-3.656; 14 4.225,-3.656; 15 4.225,3.656; 16 3.575,3.656; 17 2.925,3.656; 18 2.275,3.656; 19 1.625,3.656; 20 0.975,3.656; 21 0.325,3.656; 22 -0.325,3.656; 23 -0.975,3.656; 24 -1.625,3.656; 25 -2.275,3.656; 26 -2.925,3.656; 27 -3.575,3.656; 28 -4.225,3.656
QFN-64 = smd 1.562 x 0.28: 1 -4.881,3.75; 2 -4.881,3.25; 3 -4.881,2.75; 4 -4.881,2.25; 5 -4.881,1.75; 6 -4.881,1.25; 7 -4.881,0.75; 8 -4.881,0.25; 9 -4.881,-0.25; 10 -4.881,-0.75; 11 -4.881,-1.25; 12 -4.881,-1.75; 13 -4.881,-2.25; 14 -4.881,-2.75; 15 -4.881,-3.25; 16 -4.881,-3.75; 33 4.881,-3.75; 34 4.881,-3.25; 35 4.881,-2.75; 36 4.881,-2.25; 37 4.881,-1.75; 38 4.881,-1.25; 39 4.881,-0.75; 40 4.881,-0.25; 41 4.881,0.25; 42 4.881,0.75; 43 4.881,1.25; 44 4.881,1.75; 45 4.881,2.25; 46 4.881,2.75; 47 4.881,3.25; 48 4.881,3.75 | smd 0.28 x 1.562: 17 -3.75,-4.881; 18 -3.25,-4.881; 19 -2.75,-4.881; 20 -2.25,-4.881; 21 -1.75,-4.881; 22 -1.25,-4.881; 23 -0.75,-4.881; 24 -0.25,-4.881; 25 0.25,-4.881; 26 0.75,-4.881; 27 1.25,-4.881; 28 1.75,-4.881; 29 2.25,-4.881; 30 2.75,-4.881; 31 3.25,-4.881; 32 3.75,-4.881; 49 3.75,4.881; 50 3.25,4.881; 51 2.75,4.881; 52 2.25,4.881; 53 1.75,4.881; 54 1.25,4.881; 55 0.75,4.881; 56 0.25,4.881; 57 -0.25,4.881; 58 -0.75,4.881; 59 -1.25,4.881; 60 -1.75,4.881; 61 -2.25,4.881; 62 -2.75,4.881; 63 -3.25,4.881; 64 -3.75,4.881
SOP65P640X110-16 = smd 1.572 x 0.407: 1 -2.872,2.275; 2 -2.872,1.625; 3 -2.872,0.975; 4 -2.872,0.325; 5 -2.872,-0.325; 6 -2.872,-0.975; 7 -2.872,-1.625; 8 -2.872,-2.275; 9 2.872,-2.275; 10 2.872,-1.625; 11 2.872,-0.975; 12 2.872,-0.325; 13 2.872,0.325; 14 2.872,0.975; 15 2.872,1.625; 16 2.872,2.275
VIA-0.2MM = drill 0.2 pad 0.3: P1 0,0
OSCCC320X250X85 = smd 1.262 x 1.012: 1 -1.175,-0.95; 2 1.175,-0.95; 3 1.175,0.95; 4 -1.175,0.95

### Placement (x,y rotation side)
A1  56,54 90 top
B1  17.5,11 270 top
B2  57,46 270 top
B3  18.5,49.5 180 top
B4  27.5,16 180 top
B5  27.5,6 180 top
B6  58.5,18 180 top
B7  51.5,11 270 top
B8  58.5,11 180 top
B9  65.5,11 270 top
B10  58.5,4 180 top
B12  61.5,57 180 top
C1  19,28 270 top
C2  57,48.5 0 top
C3  54,46.5 270 top
C4  62,49 270 top
C5  11,37 90 top
C6  18,37 90 top
C7  62,45 90 top
C8  62,41 90 top
C9  74,43.5 90 top
C11  43.5,51 90 top
C12  37.5,51 90 top
C13  46,34 270 top
C14  44,34 90 top
C15  37,34 90 top
C16  35,34 270 top
D1  10.5,7 270 top
D2  10.5,24.5 270 top
D3  7.5,24.5 270 top
D4  10.5,13 270 top
D5  71.5,7 270 top
D6  71.5,13 270 top
E1  40.5,11 0 top
E$1  [FRSKY-TARANIS-GIMBAL]  -39.5,30 0 top  (outside the outline)
E$2  [FRSKY-TARANIS-GIMBAL]  120.5,30 180 top  (outside the outline)
J1  68,53 180 top
J2  2.5,49 270 top
J3  78.5,31 90 top
J4  27,27 180 top
J5  16.5,50 0 bottom
J6  9.5,56 0 top
J7  33.5,31 270 bottom
J8  47.5,31 90 bottom
L1  40.5,40 0 top
P1  16,20.5 90 top
P2  29.5,20.5 90 top
P3  25,20.5 90 top
P4  20.5,20.5 90 top
R1  15,28 0 top
R3  19,24 0 top
R4  15,24 0 top
R5  71.5,24 0 top
S1  4.5,11 90 top
S2  77,11 90 top
U2  14.5,37 90 top
U3  68,45 90 top
U4  40.5,42.5 180 top
U5  68,35.5 0 top
U$1  [700MAH-BATTERY]  77,-25.5 90 top  (outside the outline)
U$2  [QUADCLASS_LOGO_SMALL]  10.5,18.5 0 top
U$3  [LAYER_LABELS]  39.5,-12 0 top  (outside the outline)
U$4  [375MAH-BATTERY]  -31.5,32 0 top  (outside the outline)
U$5  [600MAH-BATTERY]  41.5,82 90 top  (outside the outline)
V1  11.5,39 180 top
V2  11.5,40 180 top
V3  12.5,35 0 top
V4  17.5,35 180 top
V5  15,35 0 top
V6  17.5,39 180 top
V7  10.5,35 180 top
V8  14.5,35 180 top
V9  52.5,49 0 top
V23  13.5,39 180 top
V24  9.5,39 180 top
V26  12.5,39 180 top
V27  10.5,40 180 top
V28  10.5,39 180 top
V30  17.5,40 180 top
V31  18.5,39 180 top
V32  19.5,39 180 top
V33  15.5,39 180 top
V34  16.5,40 180 top
V35  11.5,35 180 top
V36  16.5,39 180 top
V37  16,35 180 top
V38  13.5,35 180 top
Y1  40.5,34 0 top

### Tracks (layer width: path | path; a pad name or v marks a point on that pad's centre or on a via)
3V3  (via drill 0.2)
  Top 0.127: R3.8 v20.37,24.75 | U4.44 v34.48,40.75 | U4.34 v34.48,45.75 | U4.59 v41.75,36.48 | U4.54 v39.25,36.48 | U4.23 v41.25,48.52 | D4.A1 v11.7,13.73 | R1.5 v16.37,27.25 | S2.3 v74.65,13.5 | C16.1 v35,35.62 | C4.2 v62,47.39 | R5.6 v72.87,23.75 | R5.5 v73.61,23.25 | C12.1 v37.5,49.39 | U5.16 v72.01,37.77 | U3.17 v63.29,47.92 | U3.4 v72.71,42.73 | C9.1 v74,41.88
  Bottom 0.127: J5.VCC v17.77,52.57
  pour Route15 (rank 2): -5.5,72.49 50,72.49 50,59 61,59 61,72.5 86.5,72.5 86.5,-1.5 -5.5,-1.5
ANTENNA
  Top 0.127: B2.1 56.2,46.81 56.25,46.86
  Top 1.016: A1.FEED 56.25,50.45 C2.1 56.25,46.86
BAT_SENSE  (via drill 0.2)
  Top 0.127: R3.3 18.75,23.75 19.25,24.25 R3.7 22.25,24.25 24,22.5 27.5,22.5 28.75,23.75 v28.75,26.25 | v36.25,27 46.75,27 48.25,28.5 48.25,39.25 46.25,41.25 U4.6
  Bottom 0.127: v28.75,26.25 30.75,28.25 35,28.25 v36.25,27
BCAP
  Top 0.127: B2.2 55.95,45.75 C3.2
BPOS  (via drill 0.38)
  Top 0.508: U2.3 v16.84,37.95 | B3.P v17.5,42.36 | S1.2 v2.06,11 2,11.25 2,12.5 1.25,13.25 1.25,26.25 8,33 8,40.75 8.25,41 v12.6,41 | 17,37 17.25,36.75 17.5,36.75 C6.1
  Route2 0.508: v17.5,42.36 V30.P1 | v12.6,41 13.5,41 V33.P1
  pour Top: 14,37 20,37 20,40.5 14,40.5
  pour Bottom (rank 2): 14,37 20,37 20,40.5 14,40.5
BTN1/SCL  (via drill 0.2)
  Top 0.127: v40.25,44.75 U4.25 | v34.25,19.25 34.25,17.5 31.25,14.5 B4.3
  Route2 0.127: v40.25,44.75 40.25,42 34.25,36 v34.25,19.25
BTN2/SDA  (via drill 0.2)
  Top 0.127: v39.75,45.25 U4.26 | v31,19.25 29.5,17.75 29.5,6 31,4.5 B5.3
  Route2 0.127: v39.75,45.25 39.75,42 31,33.25 v31,19.25
BTN_CENTER  (via drill 0.2)
  Top 0.127: U4.53 38.75,36.25 39,36 v39.75,36 | v57,28 57,26.5 64,19.5 B9.1
  Bottom 0.127: v39.75,36 41.25,36 43.5,33.75 50.5,33.75 56.25,28 v57,28
BTN_DOWN  (via drill 0.2)
  Top 0.127: U4.28 38.75,46.5 36.75,44.5 36.75,44 40.5,40.25 v42.25,40.25 | v56.5,28.5 56.5,20.25 57,19.75 57,7.5 55,5.5 B10.2
  Bottom 0.127: v42.25,40.25 46.25,36.25 49.5,36.25 56.5,29.25 v56.5,28.5
BTN_LEFT  (via drill 0.2)
  Top 0.127: U4.51 37.75,34 36.25,34 36.25,31.75 v40,28 | v47,21 47,17.75 50,14.75 B7.1
  Bottom 0.127: v47,21 v40,28
BTN_RIGHT  (via drill 0.2)
  Top 0.127: v38.25,36.25 U4.52 | v55,28.5 55,21.25 56.5,19.75 56.5,14 55,12.5 B8.2
  Bottom 0.127: v38.25,36.25 41.25,33.25 50.25,33.25 v55,28.5
BTN_UP  (via drill 0.2)
  Top 0.127: U4.50 37.25,36.5 35.75,35 35.75,29 34.5,27.75 34.5,27.25 38.5,23.25 v45.75,23.25 | v47.5,21.5 52.75,21.5 54.75,19.5 B6.2
  Bottom 0.127: v47.5,21.5 v45.75,23.25
CLK_NEG
  Top 0.152: U4.56 40.25,33.98 Y1.1 37.2,33.05 C15.1
CLK_POS
  Top 0.152: U4.57 40.82,37.55 40.82,36.73 41.67,35.88 Y1.3 42.3,34.95 C14.1
CTS
  Top 0.127: U3.11 71.5,47.25 71,47.25 67.25,43.5 67.25,38.5 66,37.25 65.25,37.25 U5.2
CTS-1  (via drill 0.2)
  Top 0.127: v61,35.5 63.25,37.75 65,37.75 U5.1
  Route15 0.127: v61,35.5 60.5,36 56.5,36 49,43.5 47.25,43.5 v46.75,44
  Bottom 0.127: v46.75,44 39.25,44 35,48.25 22.25,48.25 20.5,50 20.5,50.5 J5.CTS
DTR
  Top 0.127: U3.2 71.75,41.5 72.25,41.5 72.75,41 72.75,37.5 71.75,36.5 71,36.5 U5.14
DTR-0  (via drill 0.2)
  Top 0.127: v22.75,29 21,27.25 C1.2 | v69.25,37.5 69.75,37.5 70,37.25 70.75,37.25 U5.15
  Route2 0.127: v22.75,29 33.75,40 33.75,41.5 39,46.75 60,46.75 v69.25,37.5
DTR-1  (via drill 0.2, 0.38)
  Top 0.127: v66.5,36.25 68.25,36.25 68.5,36 70.75,36 U5.13 | J6.DTR 11.18,47.6 v12.5,47.6
  Route15 0.127: v66.5,36.25 66.25,36.5 57,36.5 v49.5,44
  Bottom 0.127: v49.5,44 40.25,53.25 12.25,53.25 10.25,51.25 10.25,50.75 J5.DTR 10.4,50.39 10.4,49.7 v12.5,47.6
E1-A  (via drill 0.2)
  Top 0.127: U4.40 34.75,42.75 33.5,41.5 v33.5,21.5
  Bottom 0.127: v33.5,21.5 36.5,18.5 36.5,5 E1.A
E1-B  (via drill 0.2)
  Top 0.127: U4.41 34.75,42.25 34,41.5 34,24.75 v37.25,21.5
  Bottom 0.127: v37.25,21.5 42,16.75 42,4.5 E1.B
E1-BUT  (via drill 0.2)
  Top 0.127: v39.25,44.75 U4.27
  Route15 0.127: v39.25,44.75 39.25,40 38.75,39.5 38.75,19.25 38,18.5 E1.BUTA
GND  (via drill 0.2)
  Top 0.127: U3.26 v65.4,42.08 | U3.25 v66.02,42.73 | U3.21 v65.4,45.33 | U3.18 v65.4,47.27 | U3.7 v70.6,44.67 | U5.8 v66.27,33.23 | U4.45 v36.75,40.25 | U4.35 v36.75,45.25 | U4.61 v42.75,38.75 | U4.58 v41.25,38.75 | U4.55 v39.75,38.75 | U4.20 v42.75,46.25 | U4.24 v40.75,46.25 | B3.G v19.5,46.15 | B3.G2 v21.7,47.85 | B3.G3 v15.3,47.85 | U2.2 v14.85,37 | J1.5 v66.7,54.03 | J1.8 v71.8,54.37 | J1.10 v69.2,54.37 | J1.9 67.3,55.17 v67.3,54.37 | J1.11 v64.2,54.37 | B5.2 v25.05,7.5 | B5.1 v29.95,7.5 | L1.GND2 v48.5,55.33 | B7.3 v51.85,14.6 | B7.4 v51.85,7.4 | B9.3 v65.85,14.6 | B9.4 v65.85,7.4 | B1.3 v17.85,14.6 | B1.4 v17.85,7.4 | J4.6 v24.46,26.39 | B10.4 v56.05,2.5 | B10.3 v60.95,2.5 | B8.4 v56.05,9.5 | B8.3 v60.95,9.5 | S2.1 v76.95,8.5 | B4.2 v25.05,17.5 | B4.1 v29.95,17.5 | B6.4 v56.05,16.5 | B6.3 v60.95,16.5 | C9.2 v74,45.12 | C12.2 v37.5,52.61 | R5.1 v70.13,24.75 | R5.2 v69.39,24.25 | C11.2 v43.5,52.61 | R1.3 v13.63,27.75 | R3.2 v17.63,24.25 | R3.4 v17.63,23.25 | C6.2 v18,38.62 | C5.2 v11,38.62 | R4.1 v13.63,24.75 | R4.2 v12.89,24.25 | D1.C1 v11.7,6.27 | C16.2 35.3,32.95 v35.3,32.28 | C8.2 v62,42.62 | C14.2 v44,35.62 | C15.2 v37,35.62 | C13.2 v46,32.38 | C4.1 v62,50.61 | J6.GND v6.29,47.19
  Bottom 0.127: J8.3 v46.2,29.73 | J8.6 v46.2,37.35 | J7.3 33.16,31.97 v34.8,31.97 | J7.6 v34.8,24.65 | J5.GND v22.85,48.7
  pour Bottom: 20,36.5 8.5,36.5 8.5,34 20,34
  pour Top (rank 2): 50,64 -5,64 -5,-3 86,-3 86,64 61,64 61,51 50,51
  pour Route2: -6,65 50,65 50,51 61,51 61,65 87,65 87,-1 -6,-1
  pour Bottom (rank 4): 50,65.5 -6.5,65.5 -6.5,-1.5 87.5,-1.5 87.5,65.5 61,65.5 61,51 50,51
GREF  (via drill 0.2)
  Top 0.127: R1.4 13.5,27.25 13,27.75 13,33.75 14,34.75 14,39.62 14.7,40.32 14.7,40.7 | J2.1 2.5,50.25 1.5,49.25 1.5,46 J2.4 10.5,45 14.7,40.81 14.7,40.7 | J3.4 79.5,34 79.5,30.75 78.5,29.75 J3.1 54.75,29 51.75,26 v51.75,25.75 | v25,33.5 25,35.64 19.94,40.7 14.7,40.7
  Bottom 0.127: 30.5,33.5 30.5,35.5 32.25,37.25 32.75,37.25 J7.1 | 30.5,33.5 30.5,31.5 31,31 31.5,31 32.75,29.75 J7.4 33,29.75 44,29.75 46.5,32.25 48,32.25 J8.4 48.25,32.25 48.75,32.25 50.5,30.5 50.5,27 | 50.5,27 50.5,26.75 49.75,26 49.5,26 48.25,24.75 J8.1 | 50.5,27 v51.75,25.75 | 30.5,33.5 v25,33.5
LCD_RX  (via drill 0.2)
  Top 0.127: v36.5,55.25 36,55.75 36,57.5 L1.RXI | v37.5,54.25 37.5,53.25 36.75,52.5 U4.32
  Bottom 0.127: v37.5,54.25 v36.5,55.25
LCD_TX
  Top 0.127: U4.31 37.25,48.25 38.25,49.25 38.25,54.25 L1.TX0
MISO  (via drill 0.2)
  Top 0.127: v31.75,43.25 U4.39 | v30.25,41.75 30.25,30.25 J4.1
  Bottom 0.127: v30.25,41.75 v31.75,43.25
MOSI  (via drill 0.2)
  Top 0.127: U4.38 36.5,43.75 37.5,42.75 v37.5,40.5 | v26,26.25 26,25.5 27,24.5 J4.4
  Route2 0.127: v37.5,40.5 37.5,40.25 26.5,29.25 26.5,26.75 v26,26.25
N$1  (via drill 0.2)
  Top 0.127: v14.5,22.25 14.5,23.25 R4.4 | v15.5,16.25 14.75,15.5 14.75,11.5 11,7.75 D1.A1
  Bottom 0.127: v14.5,22.25 14.5,21.5 13.75,20.75 13.75,18 v15.5,16.25
N$2  (via drill 0.2)
  Top 0.127: v13.25,23.75 R4.3 | v8.25,18.75 8,18.75 4.5,15.25 4.5,10.5 5.75,9.25 6.75,9.25 9.5,6.5 10,6.5 D1.C2
  Bottom 0.127: v8.25,18.75 v13.25,23.75
N$3
  Top 0.127: R5.3 70.5,23.75 70,23.25 70,7.75 70.75,7 71.5,7 72,7.5 D5.A1
N$4
  Top 0.127: R5.8 73.25,24.75 74.75,23.25 74.75,14.25 72.5,12 72.5,11.75 72.25,11.5 71.5,11.5 71.25,11.75 71.25,12.25 D6.C2
N$5
  Top 0.127: R5.7 73.25,24.25 74.25,23.25 74.25,14.75 72,12.5 D6.C1
N$6  (via drill 0.2)
  Top 0.127: R4.7 16.75,24.25 17,24 17,23.25 v15.25,21.5 | v14.25,20.5 14.25,20 12.5,18.25 12,18.25 10.75,17 10.75,16 12.25,14.5 12.25,13.5 11,12.25 D4.C1
  Bottom 0.127: v14.25,20.5 v15.25,21.5
N$7
  Top 0.127: R5.4 70.75,23.25 70.75,14.5 70.5,14.25 70.5,8.25 71,7.75 D5.A2
N$8  (via drill 0.2)
  Top 0.127: v71.25,22 71.25,13.75 D6.A2 | v48.75,44 47.5,44 46.25,45.25 U4.14
  Route2 0.127: v71.25,22 69.5,23.75 69.25,23.75 49.5,43.5 49.25,43.5 v48.75,44
N$9  (via drill 0.2)
  Top 0.127: v68.5,28 71.5,25 71.5,23 71.75,22.75 71.75,13.75 D6.A1 | v49.5,44.75 47.25,44.75 46.25,45.75 U4.15
  Route2 0.127: v68.5,28 66.25,28 v49.5,44.75
N$11  (via drill 0.2)
  Top 0.127: 15.75,23.75 15.75,23.25 R4.5 | v16.5,23.75 15.75,23.75 | v17,26.75 17,35 16,36 U2.1 | 15.75,23.75 R4.6
  Bottom 0.127: v16.5,23.75 16.5,26.25 v17,26.75
N$12
  Top 0.127: R1.6 15.25,27.75 15,27.5 15,27 14.75,26.75 13.5,26.75 12.5,27.75 12.5,34.25 13,34.75 13,36 U2.5
N$13  (via drill 0.2)
  Top 0.127: R4.8 15.25,24.75 15,24.5 v15,22.75 | v9.25,18.25 9.25,18 10.25,17 10.25,15 9.5,14.25 9.5,13 10,12.5 D4.C2
  Bottom 0.127: v15,22.75 13.75,22.75 v9.25,18.25
N$14
  Top 0.127: D2.2 10.5,20.25 8.5,18.25 8,18.25 5.75,16 5.75,13.5 S1.7
N$20
  Top 0.127: C11.1 43.5,49.5 42.5,48.5 | 42.5,48.5 42.25,48.25 U4.21 | U4.22 41.75,48.25 42,48.5 42.5,48.5
N$21
  Top 0.127: U4.60 42.25,36.75 42.5,36.5 43.75,36.5 45.25,35 46,35 C13.1
PITCH  (via drill 0.2)
  Top 0.127: U4.2 46.25,39.25 47.75,37.75 v47.75,35.75 | J3.V 57,31 v55.5,29.5
  Bottom 0.127: v47.75,35.75 47.75,35.25 48,35 J8.V 48.25,35 50,35 v55.5,29.5
PROG_SEL  (via drill 0.2)
  Top 0.127: U5.4 65.25,35.75 68.25,35.75 68.75,35.25 70.75,35.25 U5.12 71,35 71.75,35 72.25,34.5 v72.75,34.5 | v76.5,28.5 76.5,24 77,23.5 77,13 76,12 76,11 S2.2
  Bottom 0.127: v76.5,28.5 76.5,30.75 v72.75,34.5
RESET  (via drill 0.2)
  Top 0.127: v17.75,25.25 18.25,24.75 R3.1 | v17.75,26.75 17.75,27.5 C1.1 19,29 19.5,29.5 24.25,29.5 J4.5 | v37.25,44.25 U4.12 | B1.1 16,16.75 v17.75,18.5
  Bottom 0.127: v37.25,44.25 34.5,41.5 32.25,41.5 17.75,27 v17.75,26.75 v17.75,25.25 18.25,24.75 18.25,23.25 17.75,22.75 v17.75,18.5
RF  (via drill 0.2)
  Top 0.127: v11.5,14.5 10.5,14.5 10.25,14.25 10.25,13.75 D4.A2 | v40.75,45.5 43.75,45.5 44.5,46.25 U4.16
  Route2 0.127: v11.5,14.5 16.25,19.25 16.5,19.25 19.5,22.25 19.5,25 21,26.5 22.75,26.5 25,28.75 25,30.75 34.25,40 34.75,40 38.75,44 38.75,45 39.5,45.75 40.5,45.75 v40.75,45.5
RF_N
  Top 0.152: U4.9 54.25,42.75 56.5,45 56.5,45.05 B2.3
RF_P
  Top 0.152: U4.8 54.14,42.25 57.25,45.35 B2.4
ROLL  (via drill 0.2)
  Top 0.127: v47.25,28.25 47.25,35.5 45.5,37.25 45.5,38.75 U4.1
  Bottom 0.127: v47.25,28.25 47.25,27.75 47.75,27.25 | 47.75,27.25 48,27 J8.H 47.75,27.25 | J3.H 78,37 76,35 72.5,35 69,31.5 69,27 65.5,23.5 46.5,23.5 46,24 46,25.5 47.75,27.25
RXI
  Top 0.127: U3.5 71.75,43.25 73,43.25 73.25,43 73.25,34.25 73,34 71,34 U5.10
RXI-0  (via drill 0.2)
  Top 0.127: v38.25,39.25 U4.47 | v57.5,32 65.75,32 68.25,34.5 70.75,34.5 U5.11
  Route2 0.127: v38.25,39.25 39.5,38 51.5,38 v57.5,32
RXI-1  (via drill 0.2)
  Top 0.127: v35,19.25 44.5,19.25 56.75,31.5 65.75,31.5 67.5,33.25 70.75,33.25 U5.9 | v26,27.75 26,40.25 19,47.25 14.75,47.25 12.5,49.5 | 12.5,49.5 11,51 J6.RXI | 12.5,49.5 v13.75,50.75
  Bottom 0.127: v35,19.25 29,25.25 28.5,25.25 v26,27.75 | v13.75,50.75 12.75,50.75 J5.RXI
RXLED  (via drill 0.2)
  Top 0.127: v68.5,27.25 68.5,8.75 70.75,6.5 71,6.5 D5.C2 | v63,39 63,40.25 62.75,40.5 62.75,43.75 63.75,44.75 64.25,44.75 U3.22
  Bottom 0.127: v68.5,27.25 63,32.75 v63,39
SCK  (via drill 0.2)
  Top 0.127: v31.75,44.25 U4.37 | v30.25,44.25 30.25,42.5 27,39.25 J4.3
  Bottom 0.127: v30.25,44.25 v31.75,44.25
THROTTLE  (via drill 0.2)
  Top 0.127: v35,27.5 41.75,27.5 46.75,32.5 46.75,35.5 44.75,37.5 44.25,37.5 U4.64 | J2.V 12.5,49 15.5,46 18.25,46 18.5,45.75 18.5,42.5 25.5,35.5 v25.5,29
  Bottom 0.127: v35,27.5 34.5,27 33,27 J7.V 32.75,27.25 31.25,27.25 29.75,25.75 28.5,25.75 28.25,26 28.25,26.25 v25.5,29
TXLED  (via drill 0.2)
  Top 0.127: v68,28.5 68,8.25 70.75,5.5 71.5,5.5 71.75,5.75 71.75,6.25 D5.C1 | v63.5,39.5 63.5,40.25 63.25,40.5 63.25,43.5 63.75,44 64.25,44 U3.23
  Bottom 0.127: v68,28.5 68,34 63.5,38.5 v63.5,39.5
TXO  (via drill 0.2)
  Top 0.127: v68.75,36.5 68.75,38 71.5,40.75 U3.1 | v68,35.25 66.5,35.25 65.75,34.5 65.25,34.5 U5.6
  Bottom 0.127: v68.75,36.5 68.75,36 v68,35.25
TXO-0  (via drill 0.2)
  Top 0.127: v44,39.75 U4.46 | v59,32.5 63,32.5 64.25,33.75 65,33.75 U5.7
  Bottom 0.127: v44,39.75 50.5,39.75 58,32.25 58.75,32.25 v59,32.5
TXO-1  (via drill 0.2)
  Top 0.127: v58.25,32.75 60.5,35 65,35 U5.5 | v14.25,52.25 13.5,53 10,53 8.25,51.25 J6.TXO
  Bottom 0.127: v58.25,32.75 50,41 41.75,41 35.5,47.25 18,47.25 15.25,50 15.25,50.5 J5.TXO 15,50.75 15,51.5 v14.25,52.25
USB_D_N
  Top 0.152: U3.16 65.47,48.58 68.65,51.75 J1.2
USB_D_P
  Top 0.152: U3.15 65.72,49.23 68,51.5 J1.3
VBAT  (via drill 0.2, 0.38)
  Top 0.127: R3.6 v20.5,23.75
  Top 0.508: v2.06,13.5 S1.3 3.25,13.75 3.25,18 7.16,21.91 v7.3,21.92 7.3,22.77 D3.2
  Route2 0.508: v7.3,21.92 9.18,23.8 10.89,22.09 10.89,13.68 11.45,13.12 11.96,13.12 12.31,13.47 12.31,14.43 19.95,22.07 21.3,22.07 21.3,23.8 20.55,23.8 v20.5,23.75
VBUS  (via drill 0.38)
  Top 0.127: R3.5 19.62,23.12
  Top 0.508: S1.6 v6.94,11 7,10.75 9,8.75 | D1.A2 v9.21,7.73 9,7.75 9,8.75 | U2.4 v12.16,37.95 | J1.1 v69.3,51.88 69.25,51.75 69.25,46.25 66.75,43.75 66.75,41.75 63.25,38.25 62.75,38.25 44.5,20 30.75,20 30,19.25 17.5,19.25 | 10,37 10.25,36.75 10.5,36.75 C5.1 | 8.75,37 8.75,29 6.5,26.75 6.5,25.25 7.75,24 11.75,24 15.25,20.5 P1.T | 17.5,19.25 16.25,20.5 P1.T | 17.5,19.25 14.25,16 14.25,14.25 9,9 9,8.75 | P1.T 18.2,22.7 18.93,22.7 19.35,23.12 19.62,23.12
  pour Top: 13.5,37 8.5,37 8.5,40.5 13.5,40.5
  pour Bottom: 13.5,37 8.5,37 8.5,40.5 13.5,40.5
VIN
  Top 0.508: U3.20 64.25,46 63.5,46 63,45.5 63,45 62.25,44.25 C7.1 62,44 61,43 61,41 61.25,40.75 61.5,40.75 C8.1 62,38.5 44.25,20.75 29.75,20.75 P2.T 29.5,24.25 J4.2 29.75,24.5 31,25.75 31,27 | D3.1 7.5,26 10.5,26 D2.1 10.75,26 23,26 24,27 31,27 | 31,27 31,48.75 37.75,55.5 40.25,55.5 42.25,57.5 45.75,57.5 L1.RAW
YAW  (via drill 0.2)
  Top 0.127: U4.63 43.75,38.5 43,39.25 v39.25,39.25
  Bottom 0.127: J7.H 33,34.75 35.25,34.75 39.25,38.75 v39.25,39.25 39.25,43 37.5,44.75 4.75,44.75 3,43 J2.H

### Text on the board
tPlace: B | G | Ignore four drills outside of board area | Ignore four drills outside of board area | Steven / Swanson | BLK | VBUS | GND | 3V3 | VBAT | ON | QUAD | RX/TX | PWR | STATUS | BTN1 | FTDI RX | FTDI TX | CHARGE | DONE | OFF | RST | RC | BTN2 | Mark IV | Rev 8 | CSE176e Remote
Document: Mounting w/o LCD: / 1.6mm controller board / 9mm standoff (3x donuts) / 3mm baseplate / 1.6mm runout / 15.2mm total / ~5/8in total | Mounting w/ LCD: / 1.6mm LCD / 12mm standoff (4x) / 1.6mm controller board / 9mm standoff (3x donuts) / 3mm baseplate / 1.6mm nut / 28.8 mm total / ~1 1/4 in | Mounting gimbals: / 1in standoffs.
tDocu: Pinout looking into the connector / Top: Orange Yellow Green / Bottom: Red Brown Black
baseplateart: CSE176e | <--THROTTLE--> | <--PITCH--> | <--YAW--> | To achieve great things, two things are needed: a plan and not quite enough time. / --Leonard Bernstein | <--ROLL-->